# Altium project EVB-A32S1-M.PrjPcb (part 1 of 2)
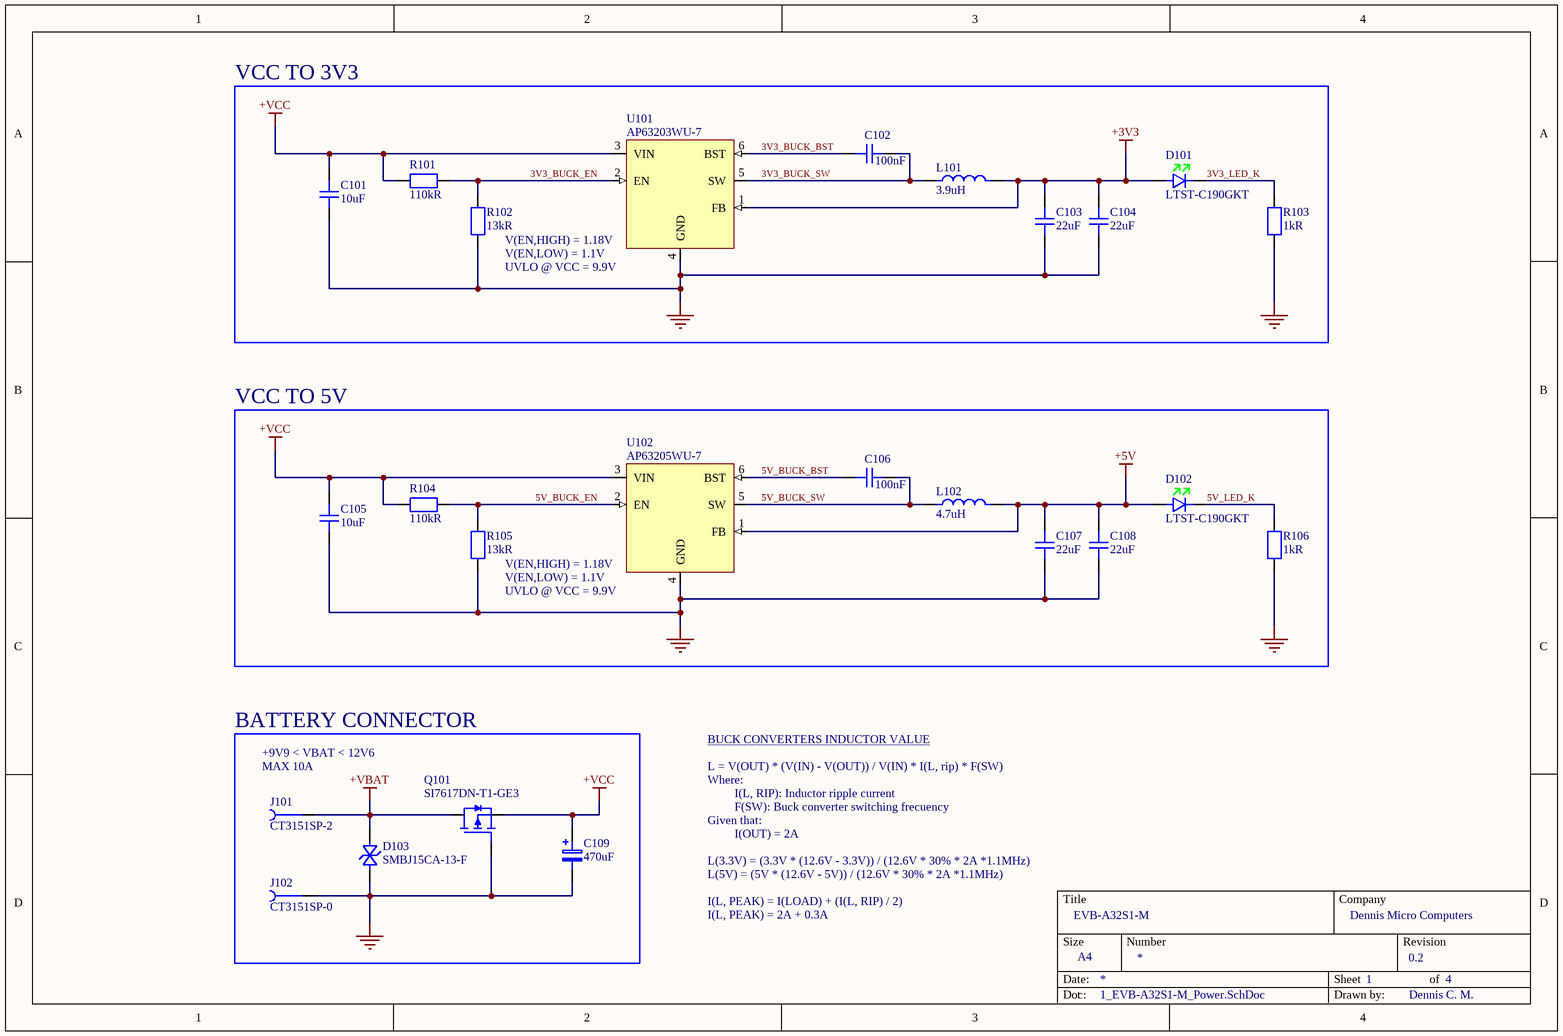
[diagram p0: 1_EVB-A32S1-M_Power.SchDoc]
CompanyName: Dennis Micro Computers; DrawnBy: Dennis C. M.; Revision: 0.2; Title: EVB-A32S1-M
4 sheets, 111 parts. Net scope: flat (ports and power ports of the same name join across sheets).
Board file: EVB-A32S1-M_PCB.PcbDoc
Sheets:
  1_EVB-A32S1-M_Power.SchDoc
  2_EVB-A32S1-M_MCU.SchDoc
  3_EVB-A32S1-M_Motor.SchDoc
  4_EVB-A32S1-M_Sensing.SchDoc

## Sheet 1_EVB-A32S1-M_Power.SchDoc: EVB-A32S1-M
size A4; SheetNumber: 1; SheetTotal: 4

### Parts
C101  value 10uF  [C_Samsung_CL_0805_A]  (hidden comment: CL21A106KOQNNNE)
C102  value 100nF  [C_Samsung_CL_0402_A]  (hidden comment: CL05B104KP5NNNC)
C103  value 22uF  [C_Yageo_CC_0805_A]  (hidden comment: CC0805MKX5R6BB226)
C104  value 22uF  [C_Yageo_CC_0805_A]  (hidden comment: CC0805MKX5R6BB226)
C105  value 10uF  [C_Samsung_CL_0805_A]  (hidden comment: CL21A106KOQNNNE)
C106  value 100nF  [C_Samsung_CL_0402_A]  (hidden comment: CL05B104KP5NNNC)
C107  value 22uF  [C_Yageo_CC_0805_A]  (hidden comment: CC0805MKX5R6BB226)
C108  value 22uF  [C_Yageo_CC_0805_A]  (hidden comment: CC0805MKX5R6BB226)
C109  value 470uF  [C_Rubycon_10x16mm_TH]  (hidden comment: 35ZLH470MEFC10X16)
D101  LTST-C190GKT  [D_LED_Lite-On_Green_0603_A]
D102  LTST-C190GKT  [D_LED_Lite-On_Green_0603_A]
D103  SMBJ15CA-13-F  [D_TVS_BI_Diodes_SMBJ15CA-13-F_A]
J101  CT3151SP-2  [J_CalTest_CT3151SP-2]
J102  CT3151SP-0  [J_CalTest_CT3151SP-0]
L101  value 3.9uH  [L_Murata_1255AY-XXXX=P3]  (hidden comment: 1255AY-3R9N=P3)
L102  value 4.7uH  [L_Murata_1255AY-XXXX=P3]  (hidden comment: 1255AY-4R7M=P3)
Q101  SI7617DN-T1-GE3  [Q_Vishay_PowerPACK-1212-8]
R101  value 110kR  [R_Yageo_RCL_0402_A]  (hidden comment: RC0402FR-07110KL)
R102  value 13kR  [R_Yageo_RCL_0402_A]  (hidden comment: RC0402FR-0713KL)
R103  value 1kR  [R_Yageo_RCL_0402_A]  (hidden comment: RC0402FR-071KL)
R104  value 110kR  [R_Yageo_RCL_0402_A]  (hidden comment: RC0402FR-07110KL)
R105  value 13kR  [R_Yageo_RCL_0402_A]  (hidden comment: RC0402FR-0713KL)
R106  value 1kR  [R_Yageo_RCL_0402_A]  (hidden comment: RC0402FR-071KL)
U101  AP63203WU-7  [U_Diodes_AP623xx]
U102  AP63205WU-7  [U_Diodes_AP623xx]

### Blocks framed on the sheet
VCC TO 3V3: C101-C104 D101 L101 R101-R103 U101
VCC TO 5V: C105-C108 D102 L102 R104-R106 U102
BATTERY CONNECTOR: C109 D103 J101 J102 Q101

### Nets
+3V3: C103.2 C104.2 D101.2 L101.2 U101.1(FB)
+5V: C107.2 C108.2 D102.2 L102.2 U102.1(FB)
+VBAT: D103.1 J101.1 Q101.1(D)
+VCC: C101.2 C105.2 C109.1 Q101.3(S) R101.2 R104.2 U101.3(VIN) U102.3(VIN)
GND: C101.1 C103.1 C104.1 C105.1 C107.1 C108.1 C109.2 D103.2 J102.1 Q101.2(G) R102.1 R103.1 R105.1 R106.1 U101.4(GND) U102.4(GND)
3V3_BUCK_BST: C102.2 U101.6(BST)
3V3_BUCK_EN: R101.1 R102.2 U101.2(EN)
3V3_BUCK_SW: C102.1 L101.1 U101.5(SW)
3V3_LED_K: D101.1 R103.2
5V_BUCK_BST: C106.2 U102.6(BST)
5V_BUCK_EN: R104.1 R105.2 U102.2(EN)
5V_BUCK_SW: C106.1 L102.1 U102.5(SW)
5V_LED_K: D102.1 R106.2

### Notes on the sheet
- (near U101) V(EN,HIGH) = 1.18V
- V(EN,LOW) = 1.1V
- (near U101) UVLO @ VCC = 9.9V
- (near U102) V(EN,HIGH) = 1.18V
- (near U102) UVLO @ VCC = 9.9V
- +9V9 < VBAT < 12V6
- (near J101) MAX 10A
- L = V(OUT) * (V(IN) - V(OUT)) / V(IN) * I(L, rip) * F(SW)
- BUCK CONVERTERS INDUCTOR VALUE
- Where:
- Given that:
- I(L, RIP): Inductor ripple current
- F(SW): Buck converter switching frecuency
- I(OUT) = 2A
- L(3.3V) = (3.3V * (12.6V - 3.3V)) / (12.6V * 30% * 2A *1.1MHz)
- L(5V) = (5V * (12.6V - 5V)) / (12.6V * 30% * 2A *1.1MHz)
- I(L, PEAK) = I(LOAD) + (I(L, RIP) / 2)
- I(L, PEAK) = 2A + 0.3A
- Title
- Company
- Size
- Date:
- A4
- Number
- Sheet
- Revision
- of
- Doc:
- Drawn by:

### Library data of the parts
C101 C105 = CMP-001-00022-4: Multilayer Ceramic Capacitor, 10 uF, 16 V, ± 10%, X5R, 0805 [2012 Metric]; Voltage Rating (DC): 16V; Dielectric: X7R; Radiation Hardening: No; Width: 0.049inch; Series: CL; Lead Free: Lead Free; Case/Package: 0805; Case Code (Metric): 2012; Construction: Flat; Height: 1.25mm; Voltage: 16V; Packaging: Tape and Reel; Voltage Rating: 16V; RoHS Compliant: Yes; Mounting Technology: Surface Mount; Case Code (Imperial): 0805; Length: 2mm; Min Operating Temperature: -55°C; Max Operating Temperature: 85°C; Depth: 1.25mm; Tolerance: 10%; Thickness: 0.055inch; ComponentLink1URL: https://mm.digikey.com/Volume0/opasdata/d220001/medias/docus/609/CL21A106KOQNNNE_Spec.pdf; Material: Ceramic; Package Quantity: 1; ComponentLink1Description: Datasheet
C102 C106 = CMP-001-00023-3: Multilayer Ceramic Capacitor, 0.1 uF, 10 V, ± 10%, X7R, 0402 [1005 Metric]; Voltage Rating: 10V; Dielectric: X7R; Height: 0.5mm; Tolerance: 10%; Voltage Rating (DC): 10V; Case/Package: 0402; RoHS Compliant: Yes; Packaging: Tape and Reel; Case Code (Imperial): 0402; Material: Ceramic; Case Code (Metric): 1005; Max Operating Temperature: 125°C; Mounting Technology: Surface Mount; Min Operating Temperature: -55°C; Series: CL; Construction: Flat; Depth: 0.5mm; Length: 1mm; Package Quantity: 1; Radiation Hardening: No; Thickness: 0.022inch; Width: 0.02inch
C103 C104 C107 C108 = CMP-001-00014-9: Multilayer Ceramic Capacitor, 22 uF, 10 V, ± 20%, X5R, 0805 [2012 Metric]; Voltage Rating (DC): 10V; Tolerance: 20%; ComponentLink1URL: https://www.yageo.com/upload/media/product/app/datasheet/mlcc/upy-gphc_x5r_4v-to-50v.pdf; Depth: 1.25mm; Width: 0.049inch; Termination: SMD/SMT; Packaging: Tape and Reel; Radiation Hardening: No; Min Operating Temperature: -55°C; RoHS Compliant: Yes; ComponentLink1Description: Datasheet; Length: 2mm; Dielectric: X5R; Case/Package: 0805; Case Code (Metric): 2012; Max Operating Temperature: 85°C; Weight: 0.000194oz; Case Code (Imperial): 0805; Lead Free: Lead Free; Mounting Technology: Surface Mount; Thickness: 0.057inch; Series: CC; Voltage Rating: 10V; Halogen Free: Halogen Free
C109 = CMP-001-00025-7: Cap Aluminum 470uF 35V 20% (10 X 16mm) Radial 5mm 1760mA 10000h 105 C Bulk; Life (Hours): 10000Hour; Lead Diameter: 0.6mm; Leakage Current: 3uA; Dielectric Material: Aluminium; Ripple Current: 1.76A; Impedance: 28mR; Tolerance: 20%; Construction: RADIAL; Voltage: 35V; Radiation Hardening: No; Lead Pitch: 5mm; Reach SVHC Compliant: No; Case/Package: Radial; Diameter: 10mm; Series: ZLH; Voltage Rating: 35V; Lead Free: Lead Free; Max Operating Temperature: 105°C; ComponentLink1URL: https://www.rubycon.co.jp/wp-content/uploads/catalog-aluminum/ZLH.pdf; Voltage Rating (AC): 35V; Min Operating Temperature: -40°C; Mounting Technology: Through Hole; Height: 16mm; RoHS Compliant: Yes; Termination: Radial; ComponentLink1Description: Datasheet; Packaging: Bulk
D101 D102 = CMP-007-00001-3: LED Uni-Color Green 565nm 2-Pin Chip LED T/R; Forward Current: 30mA; Forward Voltage: 2.1V; Luminous Intensity: 6mcd; Lens Transparency: Clear; Power Dissipation: 100mW; Lens Style: Flat,Diffused,Colorless,Rectangular,Clear; Lens Size: 0.8mm; Reverse Voltage: 5V; Viewing Angle: 130°; Test Current: 10mA; Dominant Wavelength: 569nm; Lens Color: Colorless; Number of Elements: 1; Voltage: 2V; Case Code (Imperial): 0603; Min Operating Temperature: -55°C; Case/Package: 0603; RoHS Compliant: Yes; Color: Green; Mounting Technology: Surface Mount; Case Code (Metric): 1608; Series: -; Width: 0.8mm; Packaging: Tape and Reel; Max Operating Temperature: 85°C; ComponentLink1Description: Datasheet; Length: 1.6mm; Package Quantity: 1; Height: 0.9mm; ComponentLink1URL: https://mm.digikey.com/Volume0/opasdata/d220001/medias/docus/858/LTST-C190GKT.pdf; Wavelength: 565nm; Depth: 0.8mm; Illumination Color: Green; Lead Free: Lead Free; Number of LEDs: 1; Pins: 2; Power Rating: 100mW; Radiation Hardening: No
D103 = CMP-004-00000-11: Tvs Diode, Bidir, 15V, 600W, Do-214Aa Rohs Compliant: Yes; Max Reverse Leakage Current: 5uA; Reverse Breakdown Voltage: 16.7V; Breakdown Voltage: 19.2V; Clamping Voltage: 24.4V; Power Line Protection: No; Max Surge Current: 24A; Number of Bidirectional Channels: 1; Test Current: 1mA; Value: 280pF; Polarity: Bidirectional; Diode Type: ZENER; Power Dissipation: 600W; Max Operating Temperature: 150°C; Package Quantity: 3000; Min Breakdown Voltage: 16.7V; Width: 3.9mm; Series: SMBJ; Peak Pulse Power: 600W; Mounting Technology: Surface Mount; Working Voltage: 15V; Peak Pulse Current: 24A; Min Operating Temperature: -55°C; Max Output current: 24A; Pins: 2; Termination: SMD/SMT; Leakage Current: 5uA; ComponentLink1Description: Datasheet; Max Breakdown Voltage: 19.2V; Case/Package: SMB; Number of Elements: 1; Max Power Dissipation: 600W; ComponentLink1URL: https://www.bourns.com/docs/Product-Datasheets/SMBJ.pdf; Lead Free: Lead Free; Packaging: Tape and Reel; Clamping Voltage-Max: 24.4V; RoHS Compliant: Yes; Length: 4.57mm; Voltage Rating (DC): 15V; Direction: Bidirectional; Radiation Hardening: No; Height: 2.62mm; Reverse Standoff Voltage: 15V
J101 = CMP-002-00001-14: Conn 4mm Safety Banana Jack F 1 POS Solder RA Thru-Hole 1 Port Bag; pin to pad: 1>1+2+3+4; Body Material: Nylon,Polyamide,PA66; Insulation: Mating End Insulated; Gender: Female; Min Operating Temperature: -20°C; Termination: Solder; ComponentLink1Description: Datasheet; Mounting Technology: Through Hole,Panel; Max Operating Temperature: 80°C; Color: Red; ComponentLink1URL: https://mm.digikey.com/Volume0/opasdata/d220001/medias/docus/4846/DS_1768_Catalog.pdf; Contact Material: Brass; Contact Plating: Nickel; Series: Cal Test; Packaging: Bulk
J102 = CMP-002-00000-17: Conn 4mm Safety Banana Jack F 1 POS Solder RA Thru-Hole 1 Port Bag; pin to pad: 1>1+2+3+4; Body Material: Nylon,Polyamide,PA66; Insulation: Mating End Insulated; Gender: Female; Packaging: Bulk; Series: Cal Test; Color: Black; Min Operating Temperature: -20°C; Contact Material: Brass; ComponentLink1URL: https://mm.digikey.com/Volume0/opasdata/d220001/medias/docus/4846/DS_1768_Catalog.pdf; Mounting Technology: Through Hole,Panel; Contact Plating: Nickel; ComponentLink1Description: Datasheet; Max Operating Temperature: 80°C; Termination: Solder
L101 = CMP-006-00002-7: Inductor Power Shielded Wirewound 3.9uH 30% 100KHz Ferrite 4.2A 0.0264Ohm DCR 2424 T/R; DC Resistance (DCR): 26.4mR; Saturation Current: 4.7A; Core Material: Ferrite; Tolerance: 30%; Shielding: Shielded; Length: 0.248inch; Packaging: Cut Tape; Min Operating Temperature: -40°C; ComponentLink1URL: https://search.murata.co.jp/Ceramy/image/img/P02/J(E)TE243B-0037_DG6045C_reference.pdf; RoHS Compliant: Yes; ComponentLink1Description: Datasheet; Height - Seated (Max): 0.177inch; Max Operating Temperature: 85°C; Mounting Technology: Surface Mount; Series: -; Case/Package: Nonstandard; Width: 0.248inch; Current Rating: 4.2A; Test Frequency: 100kHz
L102 = CMP-006-00001-10: Inductor Power Shielded Wirewound 4.7uH 20% 100KHz Ferrite 4A 0.0276Ohm DCR 2424 T/R; DC Resistance (DCR): 27.6mR; Current Rating: 4.5A; ComponentLink1Description: Datasheet; Packaging: Cut Tape; Height - Seated (Max): 0.177inch; ESR: 27.6mR; Core Material: Ferrite; Inductance Tolerance: 20%; ComponentLink1URL: https://search.murata.co.jp/Ceramy/image/img/P02/J(E)TE243B-0037_DG6045C_reference.pdf; Width: 0.248inch; Saturation Current: 4.5A; Min Operating Temperature: -40°C; Case/Package: Nonstandard; Series: DG6045C; RoHS Compliant: Yes; Tolerance: 20%; Length: 0.248inch; Test Frequency: 100kHz; Shielding: Shielded; Max Operating Temperature: 85°C; Height: 4.5mm; Max DC Current: 4A; RMS Current (Irms): 4A; Mounting Technology: Surface Mount
Q101 = CMP-00000-19: P CHANNEL MOSFET, -30V, 35A; Transistor; Transistor Polarity: P Channel; Continuous Drain Current Id: -35A; Source; pin to pad: 1>5+6+7+8 2>4 3>1+2+3; Rise Time: 43ns; Drain to Source Resistance: 12.3mR; Turn-Off Delay Time: 30ns; Turn-On Delay Time: 40ns; Threshold Voltage: -2.5V; Max Power Dissipation: 52W; Fall Time: 11ns; Power Dissipation: 3.7W; Polarity: P-CHANNEL; Number of Elements: 1; Input Capacitance: 1.8nF; Gate to Source Voltage (Vgs): 25V; Drain to Source Breakdown Voltage: -30V; Pins: 8; Max Operating Temperature: 150°C; ComponentLink1Description: Datasheet; Continuous Drain Current (ID): -35A; Mounting Technology: Surface Mount; Rds On Max: 12.3mR; Packaging: Tape and Reel; ComponentLink1URL: https://www.vishay.com/docs/65164/si7617dn.pdf; Min Operating Temperature: -55°C; Reach SVHC Compliant: No; Drain to Source Voltage (Vdss): -30V; RoHS Compliant: Yes; Package Quantity: 3000; Number of Channels: 1; Lead Free: Lead Free; Series: TrenchFET®; Radiation Hardening: No; Height: 1.12mm
R101 R104 = CMP-009-00000-11: SMD Chip Resistor, 110 kOhm, ± 1%, 63 mW, 0402 [1005 Metric], Thick Film, General Purpose; Max Power Dissipation: 63mW; Voltage Rating (DC): 50V; Temperature Coefficient: 100ppm/°C; Tolerance: 1%; Case Code (Metric): 1005; Case/Package: 0402; ComponentLink1Description: Datasheet; Depth: 0.5mm; Length: 1mm; Packaging: Tape and Reel; Max Operating Temperature: 155°C; Reach SVHC Compliant: Unknown; Case Code (Imperial): 0402; ComponentLink1URL: https://www.yageo.com/upload/media/product/products/datasheet/rchip/PYu-RC_Group_51_RoHS_L_12.pdf; Termination: SMD/SMT; Construction: Rectangular; RoHS Compliant: Yes; Min Operating Temperature: -55°C; Working Voltage: 50V; Technology: THICK FILM; Resistor Type: Thick Film; Military Standard: Not; Number of Terminations: 2; Voltage Rating: 50V; Series: RC; Power Rating: 63mW; Features: Moisture Resistant; Resistance Tolerance: 1%
R102 R105 = CMP-009-00001-11: SMD Chip Resistor, 13 kOhm, ± 1%, 63 mW, 0402 [1005 Metric], Thick Film, General Purpose; Temperature Coefficient: 100ppm/°C; Voltage Rating: 50V; Max Power Dissipation: 63mW; Power Rating: 62.5mW; ComponentLink1Description: Datasheet; Mounting Technology: Surface Mount; Max Operating Temperature: 155°C; Technology: THICK FILM; Package Quantity: 10000; Case Code (Imperial): 0402; Number of Terminations: 2; Lead Free: Lead Free; Working Voltage: 50V; Min Operating Temperature: -55°C; Width: 0.02inch; Height: 0.016inch; Tolerance: 1%; Packaging: Tape and Reel; Length: 0.039inch; Features: Moisture Resistant; Case Code (Metric): 1005; Case/Package: 0402; Depth: 0.5mm; Termination: SMD/SMT; ComponentLink1URL: https://www.yageo.com/upload/media/product/products/datasheet/rchip/PYu-RC_Group_51_RoHS_L_12.pdf; Voltage Rating (DC): 50V; Series: RC; RoHS Compliant: Yes
R103 R106 = CMP-009-00002-11: SMD Chip Resistor, 1 kOhm, ± 1%, 62.5 mW, 0402 [1005 Metric], Thick Film, General Purpose; Temperature Coefficient: 100ppm/°C; Voltage Rating (AC): 50V; Power Rating: 62.5mW; Max Power Dissipation: 63mW; Features: Moisture Resistant; Width: 0.5mm; Resistor Type: Thick Film; Packaging: Tape and Reel; Max Operating Temperature: 155°C; Construction: Rectangular; Reach SVHC Compliant: No; Termination: SMD/SMT; Voltage Rating (DC): 50V; Tolerance: 1%; ComponentLink1Description: Datasheet; Number of Terminations: 2; Depth: 0.5mm; Resistance Tolerance: 1%; ComponentLink1URL: https://www.yageo.com/upload/media/product/products/datasheet/rchip/PYu-RC_Group_51_RoHS_L_12.pdf; Height: 0.32mm; Technology: THICK FILM; RoHS Compliant: Yes; Min Operating Temperature: -55°C; Lead Free: Lead Free; Military Standard: Not; Series: RC; Case/Package: 0402; Case Code (Imperial): 0402; Pins: 2; Case Code (Metric): 1005; Voltage Rating: 50V; Length: 1mm
U101 = CMP-019-00004-17: AP63203 Series 3.3 V 2 A SMT Fixed Low IQ Synchronous Buck - TSOT-26; Max Duty Cycle: 100%; Output Voltage: 3.3V; Number of Outputs: 1; Max Supply Voltage: 32V; Switching Frequency: 1.1MHz; Min Supply Voltage: 3.8V; Nominal Supply Current: 22uA; Output Current: 2A; Min Operating Temperature: -40°C; ComponentLink1URL: https://www.diodes.com/assets/Datasheets/AP63200-AP63201-AP63203-AP63205.pdf; ComponentLink1Description: Datasheet; Max Operating Temperature: 85°C; Height: 1mm
U102 = CMP-019-00003-17: AP63205 Series 32 V 2 A 1.1 MHz Synchronous Buck Converter -TSOT-26; Number of Outputs: 1; Max Duty Cycle: 100%; Output Current: 2A; Switching Frequency: 1.1MHz; Max Supply Voltage: 32V; Output Voltage: 5V; Nominal Supply Current: 22uA; Min Supply Voltage: 3.8V; ComponentLink1URL: https://www.diodes.com/assets/Datasheets/AP63200-AP63201-AP63203-AP63205.pdf; Min Operating Temperature: -40°C; Height: 1mm; Max Operating Temperature: 85°C; ComponentLink1Description: Datasheet

## Sheet 2_EVB-A32S1-M_MCU.SchDoc: EVB-A32S1-M
size A4; SheetNumber: 2; SheetTotal: 4
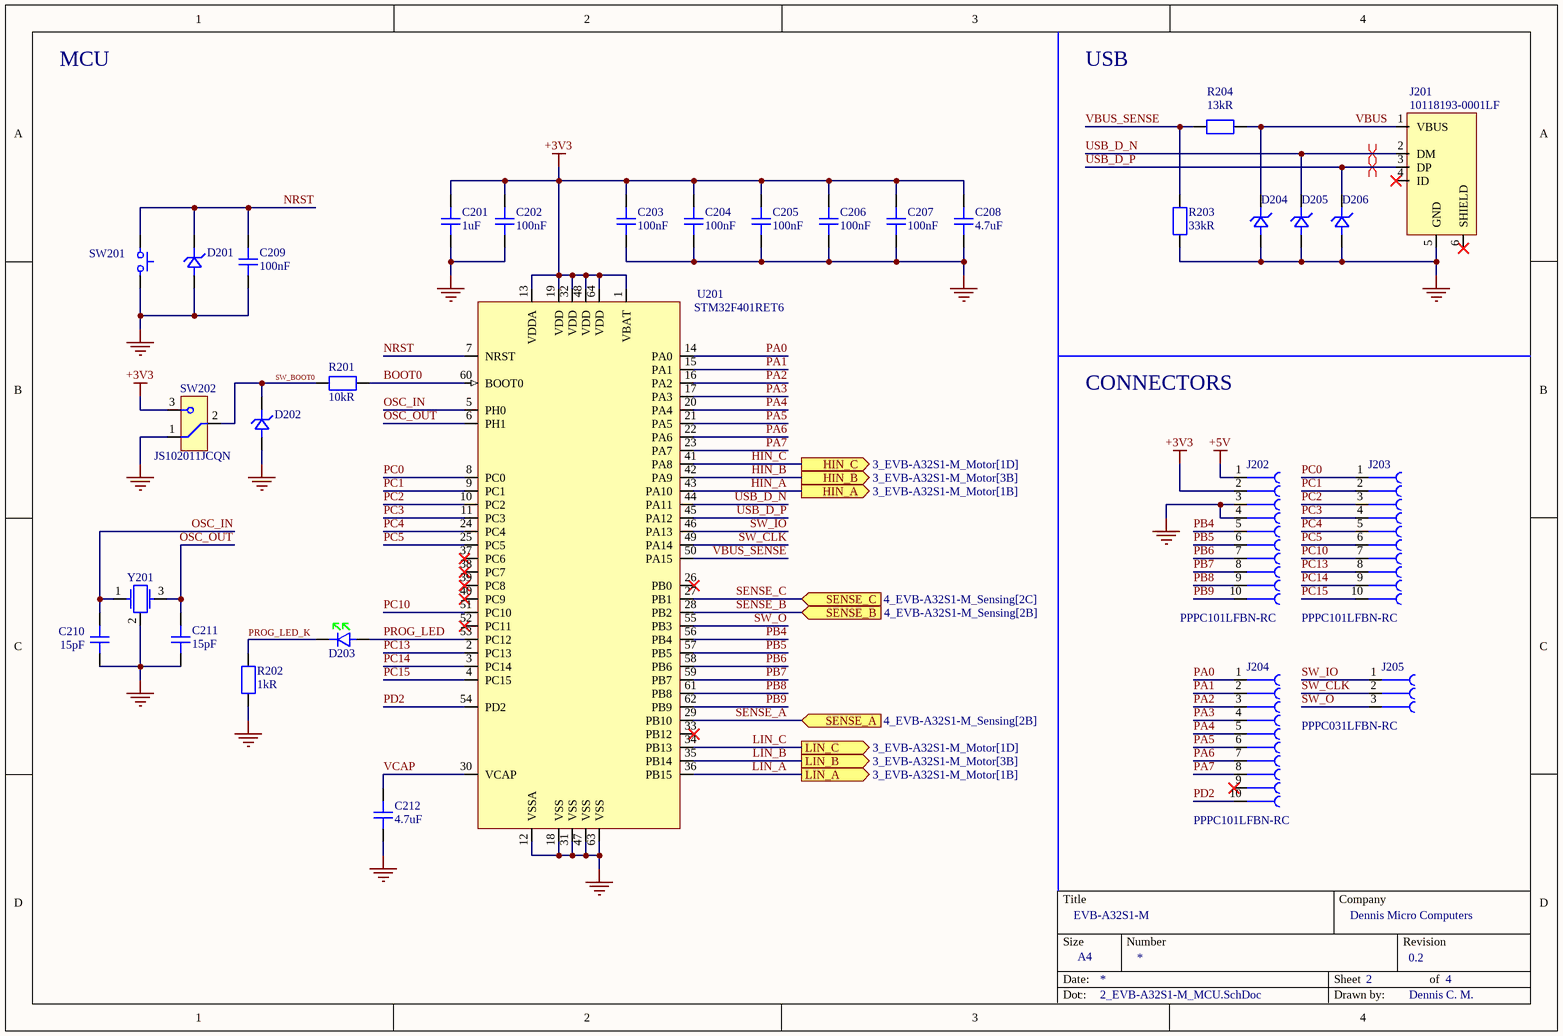
[diagram p1: 2_EVB-A32S1-M_MCU.SchDoc]

### Parts
C201  value 1uF  [C_Yageo_CC_0603_A]  (hidden comment: CC0603KRX7R7BB105)
C202  value 100nF  [C_Samsung_CL_0402_A]  (hidden comment: CL05B104KP5NNNC)
C203  value 100nF  [C_Samsung_CL_0402_A]  (hidden comment: CL05B104KP5NNNC)
C204  value 100nF  [C_Samsung_CL_0402_A]  (hidden comment: CL05B104KP5NNNC)
C205  value 100nF  [C_Samsung_CL_0402_A]  (hidden comment: CL05B104KP5NNNC)
C206  value 100nF  [C_Samsung_CL_0402_A]  (hidden comment: CL05B104KP5NNNC)
C207  value 100nF  [C_Samsung_CL_0402_A]  (hidden comment: CL05B104KP5NNNC)
C208  value 4.7uF  [C_Samsung_CL_0402_A]  (hidden comment: CL05A475MP5NRNC)
C209  value 100nF  [C_Samsung_CL_0402_A]  (hidden comment: CL05B104KP5NNNC)
C210  value 15pF  [C_Yageo_CC_0402_A]  (hidden comment: CC0402JRNPO9BN150)
C211  value 15pF  [C_Yageo_CC_0402_A]  (hidden comment: CC0402JRNPO9BN150)
C212  value 4.7uF  [C_Samsung_CL_0402_A]  (hidden comment: CL05A475MP5NRNC)
D201  D5V0F1U2S9-7  [D_TVS_Uni_Diodes_SOD-923_B]  (value not drawn)
D202  D5V0F1U2S9-7  [D_TVS_Uni_Diodes_SOD-923_B]  (value not drawn)
D203  LTST-C190GKT  [D_LED_Lite-On_Green_0603_A]  (value not drawn)
D204  D5V0F1U2S9-7  [D_TVS_Uni_Diodes_SOD-923_B]  (value not drawn)
D205  D5V0F1U2S9-7  [D_TVS_Uni_Diodes_SOD-923_B]  (value not drawn)
D206  D5V0F1U2S9-7  [D_TVS_Uni_Diodes_SOD-923_B]  (value not drawn)
J201  10118193-0001LF  [J_USB_Micro-B_Amphenol_10118193-0001LF]
J202  PPPC101LFBN-RC  [J_Sullins_01x10_Socket_2.54mm]
J203  PPPC101LFBN-RC  [J_Sullins_01x10_Socket_2.54mm]
J204  PPPC101LFBN-RC  [J_Sullins_01x10_Socket_2.54mm]
J205  PPPC031LFBN-RC  [J_Sullins_01x03_Socket_2.54mm]
R201  value 10kR  [R_Yageo_RCL_0402_A]  (hidden comment: RC0402FR-0710KL)
R202  value 1kR  [R_Yageo_RCL_0402_A]  (hidden comment: RC0402FR-071KL)
R203  value 33kR  [R_Yageo_RCL_0402_A]  (hidden comment: RC0402FR-0733KL)
R204  value 13kR  [R_Yageo_RCL_0402_A]  (hidden comment: RC0402FR-0713KL)
SW201  PTS647SN50SMTR2LFS  [SW_Tactitle_SPST_C&K_PTS647SN50SMTR2LFS]  (value not drawn)
SW202  JS102011JCQN  [SW_Slide_C&K_JS102011JCQN]
U201  STM32F401RET6  [U_ST_LQFP64_B]
Y201  ECS-240-12-37B-CKY-TR  [Y_Crystal_GND24_ECS_240-12-37B-CKY-TR]  (value not drawn)

### Ports
HIN_A (out, see 3_EVB-A32S1-M_Motor[1B]), HIN_B (out, see 3_EVB-A32S1-M_Motor[3B]), HIN_C (out, see 3_EVB-A32S1-M_Motor[1D]), LIN_A (out, see 3_EVB-A32S1-M_Motor[1B]), LIN_B (out, see 3_EVB-A32S1-M_Motor[3B]), LIN_C (out, see 3_EVB-A32S1-M_Motor[1D]), SENSE_A (in, see 4_EVB-A32S1-M_Sensing[2B]), SENSE_B (in, see 4_EVB-A32S1-M_Sensing[2B]), SENSE_C (in, see 4_EVB-A32S1-M_Sensing[2C])

### Nets
+3V3: C201.2 C202.2 C203.2 C204.2 C205.2 C206.2 C207.2 C208.2 J202.2 SW202.3 U201.1(VBAT) U201.13(VDDA) U201.19(VDD) U201.32(VDD) U201.48(VDD) U201.64(VDD)
+5V: J202.1
GND: C201.1 C202.1 C203.1 C204.1 C205.1 C206.1 C207.1 C208.1 C209.1 C210.1 C211.1 C212.1 D201.2 D202.2 D204.2 D205.2 D206.2 J201.5(GND) J202.3 J202.4 R202.1 R203.1 SW201.2 SW202.1 U201.12(VSSA) U201.18(VSS) U201.31(VSS) U201.47(VSS) U201.63(VSS) Y201.2
BOOT0: R201.2 U201.60(BOOT0)
HIN_A: U201.43(PA10) ; port HIN_A
HIN_B: U201.42(PA9) ; port HIN_B
HIN_C: U201.41(PA8) ; port HIN_C
LIN_A: U201.36(PB15) ; port LIN_A
LIN_B: U201.35(PB14) ; port LIN_B
LIN_C: U201.34(PB13) ; port LIN_C
NRST: C209.2 D201.1 SW201.1 U201.7(NRST)
OSC_IN: C210.2 U201.5(PH0) Y201.1
OSC_OUT: C211.2 U201.6(PH1) Y201.3
PA0: J204.1 U201.14(PA0)
PA1: J204.2 U201.15(PA1)
PA2: J204.3 U201.16(PA2)
PA3: J204.4 U201.17(PA3)
PA4: J204.5 U201.20(PA4)
PA5: J204.6 U201.21(PA5)
PA6: J204.7 U201.22(PA6)
PA7: J204.8 U201.23(PA7)
PB4: J202.5 U201.56(PB4)
PB5: J202.6 U201.57(PB5)
PB6: J202.7 U201.58(PB6)
PB7: J202.8 U201.59(PB7)
PB8: J202.9 U201.61(PB8)
PB9: J202.10 U201.62(PB9)
PC0: J203.1 U201.8(PC0)
PC1: J203.2 U201.9(PC1)
PC2: J203.3 U201.10(PC2)
PC3: J203.4 U201.11(PC3)
PC4: J203.5 U201.24(PC4)
PC5: J203.6 U201.25(PC5)
PC10: J203.7 U201.51(PC10)
PC13: J203.8 U201.2(PC13)
PC14: J203.9 U201.3(PC14)
PC15: J203.10 U201.4(PC15)
PD2: J204.10 U201.54(PD2)
PROG_LED: D203.2 U201.53(PC12)
PROG_LED_K: D203.1 R202.2
SENSE_A: U201.29(PB10) ; port SENSE_A
SENSE_B: U201.28(PB2) ; port SENSE_B
SENSE_C: U201.27(PB1) ; port SENSE_C
SW_BOOT0: D202.1 R201.1 SW202.2
SW_CLK: J205.2 U201.49(PA14)
SW_IO: J205.1 U201.46(PA13)
SW_O: J205.3 U201.55(PB3)
USB_D_N: D205.1 J201.2(DM) U201.44(PA11)
USB_D_P: D206.1 J201.3(DP) U201.45(PA12)
VBUS: D204.1 J201.1(VBUS) R204.2
VBUS_SENSE: R203.2 R204.1 U201.50(PA15)
VCAP: C212.2 U201.30(VCAP)

Not connected (* = marked no-connect by the designer): J201 4(ID)* 6(SHIELD)*; J204 9*; U201 26(PB0)* 33(PB12)* 37(PC6)* 38(PC7)* 39(PC8)* 40(PC9)* 52(PC11)*

### Layout directives
differential pair; differential pair class DIFF_USB: USB_D_N, USB_D_P

### Notes on the sheet
- MCU
- USB
- CONNECTORS
- Title
- Company
- Size
- Date:
- A4
- Number
- Sheet
- Revision
- of
- Doc:
- Drawn by:

### Library data of the parts
C201 = CMP-001-00019-5: Multilayer Ceramic Capacitor, 1 uF, 16 V, ± 10%, X7R, 0603 [1608 Metric]; Voltage: 16V; Dissipation Factor: 5%; Case Code (Imperial): 0603; ComponentLink1URL: https://www.yageo.com/upload/media/product/productsearch/datasheet/mlcc/UPY-GPHC_X7R_6.3V-to-250V_24.pdf; Pins: 2; Width: 0.031inch; Tolerance: 10%; Height: 0.8mm; Radiation Hardening: No; Lead Free: Lead Free; Material: Ceramic; Reach SVHC Compliant: Unknown; Case Code (Metric): 1608; Min Operating Temperature: -55°C; Case/Package: 0603; Package Quantity: 1; Thickness: 0.035inch; Packaging: Tape and Reel; Series: CC; Termination: SMD/SMT; Max Operating Temperature: 125°C; Construction: Flat; Depth: 0.8mm; Halogen Free: Halogen Free; RoHS Compliant: Yes; Voltage Rating (DC): 16V; Dielectric: X7R; Length: 1.6mm; Voltage Rating: 16V; Mounting Technology: Surface Mount; ComponentLink1Description: Datasheet
C202-C207 C209 = CMP-001-00023-3: as C102 on sheet 1_EVB-A32S1-M_Power; Dielectric: X7R; Height: 0.5mm; Tolerance: 10%; Voltage Rating (DC): 10V; Case/Package: 0402; RoHS Compliant: Yes; Packaging: Tape and Reel; Case Code (Imperial): 0402; Material: Ceramic; Case Code (Metric): 1005; Max Operating Temperature: 125°C; Mounting Technology: Surface Mount; Min Operating Temperature: -55°C; Series: CL; Construction: Flat; Depth: 0.5mm; Length: 1mm; Package Quantity: 1; Radiation Hardening: No; Thickness: 0.022inch; Width: 0.02inch
C208 C212 = CMP-001-00024-3: Multilayer Ceramic Capacitor, 4.7 uF, 10 V, ± 20%, X5R, 0402 [1005 Metric]; Voltage Rating: 10V; Packaging: Cut Tape; Tolerance: 20%; Case Code (Metric): 1005; ComponentLink1Description: Datasheet; Mounting Technology: Surface Mount; ComponentLink1URL: https://mm.digikey.com/Volume0/opasdata/d220001/medias/docus/863/CL05A475MP5NRNC_Spec.pdf; Lead Free: Lead Free; Series: CL; Min Operating Temperature: -55°C; Material: Ceramic; Case Code (Imperial): 0402; Max Operating Temperature: 85°C; Dielectric: X5R; RoHS Compliant: Yes; Case/Package: 0402; Height: 550um
C210 C211 = CMP-001-00017-14: Multilayer Ceramic Capacitor, 15 pF, 10 V, ± 5%, X7R, 0402 [1005 Metric]; Insulation Resistance: 100GR; Dielectric: C0G; Voltage Rating (DC): 50V; Temperature Coefficient: 30ppm/°C; ComponentLink1URL: https://www.yageo.com/upload/media/product/productsearch/datasheet/mlcc/UPY-GP_NP0_16V-to-50V_18.pdf; Length: 1mm; Thickness: 0.022inch; Packaging: Tape and Reel; RoHS Compliant: Yes; Height: 0.5mm; Max Operating Temperature: 125°C; Depth: 0.5mm; Radiation Hardening: No; Termination: SMD/SMT; Width: 0.02inch; Series: CC; Tolerance: 5%; Lead Free: Lead Free; ComponentLink1Description: Datasheet; Package Quantity: 1; Min Operating Temperature: -55°C; Voltage: 50V; Case/Package: 0402; Reach SVHC Compliant: No; Case Code (Metric): 1005; Case Code (Imperial): 0402; Voltage Rating (AC): 50V; Mounting Technology: Surface Mount; Halogen Free: Halogen Free; Dielectric Material: Ceramic; Pins: 2; Voltage Rating: 50V; Material: Ceramic
D201 D202 D204-D206 = CMP-004-00007-2: Diode TVS Dual Uni-Dir 5.5V 250000W 2-Pin SOD-923 T/R; Max Power Dissipation: 250mW; ESD Protection: Yes; Max Reverse Leakage Current: 100nA; Max Surge Current: 1.5A; Diode Type: ZENER; Direction: Unidirectional; Breakdown Voltage: 6V; Clamping Voltage: 10V; Value: 5E-13F; Peak Pulse Power: 250kW; Number of Unidirectional Channels: 1; ComponentLink1Description: Datasheet; Working Voltage: 5.5V; Reverse Standoff Voltage: 5.5V; Case/Package: SOD-923-2; Max Operating Temperature: 150°C; Power Line Protection: Yes; Mounting Technology: Surface Mount; Peak Pulse Current: 1.5A; Packaging: Tape and Reel; RoHS Compliant: Yes; Package Quantity: 10000; Contact Plating: Tin,Matte; Series: -; Termination: SMD/SMT; Polarity: Unidirectional; Min Breakdown Voltage: 6V; Min Operating Temperature: -65°C; ComponentLink1URL: https://www.diodes.com/assets/Datasheets/D5V0F1U2S9.pdf
D203 = CMP-007-00001-3: LED Uni-Color Green 565nm 2-Pin Chip LED T/R; Viewing Angle: 130°; Lens Transparency: Clear; Reverse Voltage: 5V; Lens Size: 0.8mm; Lens Color: Colorless; Lens Style: Flat,Diffused,Colorless,Rectangular,Clear; Power Dissipation: 100mW; Forward Voltage: 2.1V; Dominant Wavelength: 569nm; Test Current: 10mA; Forward Current: 30mA; Luminous Intensity: 6mcd; Number of Elements: 1; Voltage: 2V; Series: -; ComponentLink1URL: https://mm.digikey.com/Volume0/opasdata/d220001/medias/docus/858/LTST-C190GKT.pdf; Packaging: Tape and Reel; Package Quantity: 1; Case Code (Imperial): 0603; Height: 0.9mm; ComponentLink1Description: Datasheet; Color: Green; Case Code (Metric): 1608; Min Operating Temperature: -55°C; Wavelength: 565nm; Length: 1.6mm; Max Operating Temperature: 85°C; Case/Package: 0603; RoHS Compliant: Yes; Mounting Technology: Surface Mount; Width: 0.8mm; Depth: 0.8mm; Illumination Color: Green; Lead Free: Lead Free; Number of LEDs: 1; Pins: 2; Power Rating: 100mW; Radiation Hardening: No
J201 = CMP-002-00002-12: Usb Connector, 5 Contact(S), Female, Right Angle, Surface Mount Terminal, Locking, Receptacle; Number of Contacts: 5; Current Rating: 1.8A; Connector Type: USB,Receptacle; Pitch: 650um; Number of Ports: 1; Voltage Rating: 100V; USB Standard: USB 2.0; Insulation Resistance: 1GR; Pins: 11; Termination: Solder; Height: 3mm; Packaging: Tape and Reel; Max Operating Temperature: 85°C; Radiation Hardening: No; Features: Shielded; Contact Material: Nickel,Gold; Series: -; Orientation: Right Angle; Min Operating Temperature: -55°C; ComponentLink2URL: https://cdn.amphenol-cs.com/media/wysiwyg/files/documentation/datasheet/inputoutput/io_usb_micro.pdf; Color: Black; Housing Material: Polymer; Mounting Technology: Surface Mount,Horizontal; ComponentLink1Description: Drawing; Depth: 5.67mm; Package Quantity: 1200; ComponentLink1URL: https://cdn.amphenol-cs.com/media/wysiwyg/files/drawing/10118193.pdf; ComponentLink2Description: Datasheet; Flammability Rating: UL94 V-0; Length: 7.86mm; Gender: Female; Contact Plating: Gold; Max Voltage Rating (AC): 100V
J202-J204 = CMP-002-00003-9: 10 Position Total Single Row 2.54 mm Pitch Straight Female Header; Voltage Rating: 250V; Number of Contacts: 10; Pitch: 0.1inch; Current Rating: 3A; Connector Type: Header; Number of Rows: 1; Package Quantity: 1000; Contact Type: Female Socket; Color: Black; Min Operating Temperature: -40°C; RoHS Compliant: Yes; Length: 25.9mm; ComponentLink1URL: https://mm.digikey.com/Volume0/opasdata/d220001/medias/docus/937/Female_Headers.100_DS.pdf; ComponentLink1Description: Datasheet; Height: 8.5mm; Contact Plating: Gold; Width: 2.5mm; Packaging: Bulk; Mounting Technology: Through Hole; Contact Material: Bronze,Nickel,Gold; Lead Free: Lead Free; Termination: Solder; Housing Material: Plastic; Number of Positions: 10; Max Operating Temperature: 105°C
J205 = CMP-002-00004-17: 3 Position Total Single Row 2.54 mm Pitch Straight Female Header; Voltage Rating: 250V; Number of Positions: 3; Pitch: 2.54mm; Series: -; Length: 8.12mm; Connector Type: Header; Insulation Color: Black; Insulation Material: Polyester; Height: 8.5mm; ComponentLink1Description: Datasheet; Termination: Solder; Contact Shape: Square; Width: 2.5mm; Fastening Type: Pull; RoHS Compliant: Yes; Contact Finish - Mating: GOLD; Number of Rows: 1; Min Operating Temperature: -40°C; Max Operating Temperature: 105°C; Flammability Rating: UL94 V-0; Contact Material: Bronze; Packaging: Tray; Contact Type: Female Socket; Lead Free: Lead Free; Mounting Technology: Through Hole; ComponentLink1URL: https://mm.digikey.com/Volume0/opasdata/d220001/medias/docus/937/Female_Headers.100_DS.pdf; Housing Material: Plastic
R201 = CMP-009-00003-11: SMD Chip Resistor, 10 kOhm, ± 1%, 62.5 mW, 0402 [1005 Metric], Thick Film, General Purpose; Power Rating: 62.5mW; Max Power Dissipation: 63mW; Temperature Coefficient: 100ppm/°C; Voltage Rating (DC): 50V; Number of Terminations: 2; Width: 0.5mm; Resistance Tolerance: 1%; Length: 1mm; Lead Pitch: 0.2mm; Case Code (Metric): 1005; Case Code (Imperial): 0402; Construction: Rectangular; Tolerance: 1%; ComponentLink1URL: https://www.yageo.com/upload/media/product/products/datasheet/rchip/PYu-RC_Group_51_RoHS_L_12.pdf; Max Operating Temperature: 155°C; Series: RC; Military Standard: Not; Depth: 0.5mm; ComponentLink1Description: Datasheet; Features: Moisture Resistant; Termination: SMD/SMT; Pins: 2; Lead Free: Lead Free; Min Operating Temperature: -55°C; Resistor Type: Thick Film; Voltage Rating: 50V; Case/Package: 0402; Packaging: Tape and Reel; RoHS Compliant: Yes; Reach SVHC Compliant: Unknown
R202 = CMP-009-00002-11: SMD Chip Resistor, 1 kOhm, ± 1%, 62.5 mW, 0402 [1005 Metric], Thick Film, General Purpose; Temperature Coefficient: 100ppm/°C; Max Power Dissipation: 63mW; Voltage Rating (AC): 50V; Power Rating: 62.5mW; Min Operating Temperature: -55°C; Case Code (Metric): 1005; Number of Terminations: 2; Case Code (Imperial): 0402; Pins: 2; Depth: 0.5mm; Construction: Rectangular; Voltage Rating: 50V; RoHS Compliant: Yes; Series: RC; Resistor Type: Thick Film; Length: 1mm; Voltage Rating (DC): 50V; Case/Package: 0402; Features: Moisture Resistant; Reach SVHC Compliant: No; Lead Free: Lead Free; Termination: SMD/SMT; Height: 0.32mm; Tolerance: 1%; ComponentLink1Description: Datasheet; Packaging: Tape and Reel; Width: 0.5mm; Resistance Tolerance: 1%; Military Standard: Not; ComponentLink1URL: https://www.yageo.com/upload/media/product/products/datasheet/rchip/PYu-RC_Group_51_RoHS_L_12.pdf; Max Operating Temperature: 155°C; Technology: THICK FILM
R203 = CMP-009-00005-12: SMD Chip Resistor, 33 kOhm, ± 1%, 63 mW, 0402 [1005 Metric], Thick Film, General Purpose; Power Rating: 63mW; Temperature Coefficient: 100ppm/°C; Voltage Rating (AC): 50V; Tolerance: 1%; Military Standard: Not; Features: Moisture Resistant; RoHS Compliant: Yes; Construction: Rectangular; Number of Terminations: 2; Min Operating Temperature: -55°C; Case Code (Metric): 1005; Resistor Type: Thick Film; Max Power Dissipation: 63mW; Voltage Rating (DC): 50V; Pins: 2; Series: RC; Termination: SMD/SMT; ComponentLink1Description: Datasheet; Max Operating Temperature: 155°C; Case/Package: 0402; Reach SVHC Compliant: No; Case Code (Imperial): 0402; Height: 0.016inch; Depth: 0.5mm; Length: 1mm; Package Quantity: 1; Lead Free: Lead Free; Resistance Tolerance: 1%; Weight: 2.3E-05oz; Width: 0.5mm; Packaging: Tape and Reel; Voltage Rating: 50V; ComponentLink1URL: https://www.yageo.com/upload/media/product/products/datasheet/rchip/PYu-RC_Group_51_RoHS_L_12.pdf
R204 = CMP-009-00001-11: SMD Chip Resistor, 13 kOhm, ± 1%, 63 mW, 0402 [1005 Metric], Thick Film, General Purpose; Voltage Rating (DC): 50V; Temperature Coefficient: 100ppm/°C; Max Power Dissipation: 63mW; Power Rating: 62.5mW; Package Quantity: 10000; Packaging: Tape and Reel; Max Operating Temperature: 155°C; Termination: SMD/SMT; Mounting Technology: Surface Mount; Min Operating Temperature: -55°C; Series: RC; Width: 0.02inch; Lead Free: Lead Free; Case Code (Metric): 1005; Tolerance: 1%; Working Voltage: 50V; Voltage Rating: 50V; ComponentLink1URL: https://www.yageo.com/upload/media/product/products/datasheet/rchip/PYu-RC_Group_51_RoHS_L_12.pdf; Case/Package: 0402; Length: 0.039inch; Height: 0.016inch; ComponentLink1Description: Datasheet; Technology: THICK FILM; Depth: 0.5mm; RoHS Compliant: Yes; Features: Moisture Resistant; Case Code (Imperial): 0402; Number of Terminations: 2
SW201 = CMP-011-00000-13: Switch Tactile N.O. SPST Round Button Gull Wing 0.05A 12VDC 100000Cycles 0.98N SMD T/R; pin to pad: 1>1+2 2>3+4; Ratings: IP40; Switch Function: Off-Mom; Illumination Type: Non-Illuminated; Actuator Type: Standard; Number of Positions: 2; Operating Force: 100gf; Switch Travel: 0.25mm; ComponentLink1URL: https://www.ckswitches.com/media/2567/pts647.pdf; Series: PTS647; Throw Configuration: SPST; Max Operating Temperature: 70°C; Mechanical Life: 100000Cycles; Min Operating Temperature: -20°C; Packaging: Cut Tape; Mounting Technology: Surface Mount; ComponentLink1Description: Datasheet; Termination: Gull Wing
SW202 = CMP-011-00001-10: JS Series Sub-Miniature Slide Switch SPDT On-On Top Slide 0.3A 6VDC J-Lead Surface Mount T/R; Voltage Rating (DC): 6V; Switch Travel: 2mm; Actuator Material: Nylon,Polyamide,PA46; Electrical Life: 5000Cycles; Actuator Type: Standard; Max Operating Temperature: 85°C; ComponentLink1Description: Datasheet; Mounting Technology: Surface Mount; ComponentLink1URL: https://www.ckswitches.com/media/1422/js.pdf; Actuator Length: 2mm; Packaging: Cut Tape; Contact Plating: Silver; Contact Material: Copper Alloy; Min Operating Temperature: -40°C; Throw Configuration: SPDT; Switch Function: On-On; Series: JS
U201 = CMP-020-00000-16: MCU 32-bit STM32 ARM Cortex M4 RISC 512KB Flash 1.8V/2.5V/3.3V 64-Pin LQFP Tray; Operating Supply Voltage: 3.3V; Peripherals: Brown-out Detect/Reset,POR,PWM,WDT,DMA; Nominal Supply Current: 1.8uA; Number of ADC Channels: 12; Interface: I2C,SPI,USB,IrDA,SDIO,UART,USART,LIN,I2S; Clock Frequency: 84MHz; Number of USB Channels: 1; Number of Timers/Counters: 8; Number of Channels: 16; Number of PWM Channels: 23; Number of UART Channels: 3; Number of Programmable I/O: 50; Watchdog Timer: Yes; Max Power Dissipation: 313mW; Min Supply Voltage: 1.7V; Data Bus Width: 32b; RAM Size: 96KB; Max Supply Voltage: 3.6V; Oscillator Type: Internal; ComponentLink1Description: Datasheet; Memory Format: FLASH; Memory Size: 512KB; Case/Package: LQFP; Core Architecture: ARM; Pins: 64; ComponentLink1URL: https://www.st.com/content/ccc/resource/technical/document/datasheet/30/91/86/2d/db/94/4a/d6/DM00102166.pdf/files/DM00102166.pdf/jcr:content/translations/en.DM00102166.pdf; Height: 1.6mm; Series: STM32 F4; Packaging: Tray; Reach SVHC Compliant: No; RoHS Compliant: Yes; Number of I/Os: 50; Frequency: 84MHz; Max Operating Temperature: 85°C; Min Operating Temperature: -40°C; Weight: 0.012088oz; Number of I2C Channels: 3; Package Quantity: 960; Number of SPI Channels: 3; Number of A/D Converters: 1; Radiation Hardening: No; Lead Free: Lead Free
Y201 = CMP-003-00000-11: Crystal 24MHz ±10ppm (Tol) ±10ppm (Stability) 12pF FUND 50Ohm 4-Pin Mini-CSMD T/R; pin to pad: 2>2+4; Case/Package: 4-SMD, No Lead; Frequency: 24MHz; Size: 0.079" L x 0.063" W (2.00mm x 1.60mm); Load Capacitance: 12pF; ComponentLink1Description: Datasheet; ComponentLink1URL: https://ecsxtal.com/store/pdf/ECX-1637B.pdf

## Sheet 3_EVB-A32S1-M_Motor.SchDoc: EVB-A32S1-M
size A4; SheetNumber: 3; SheetTotal: 4
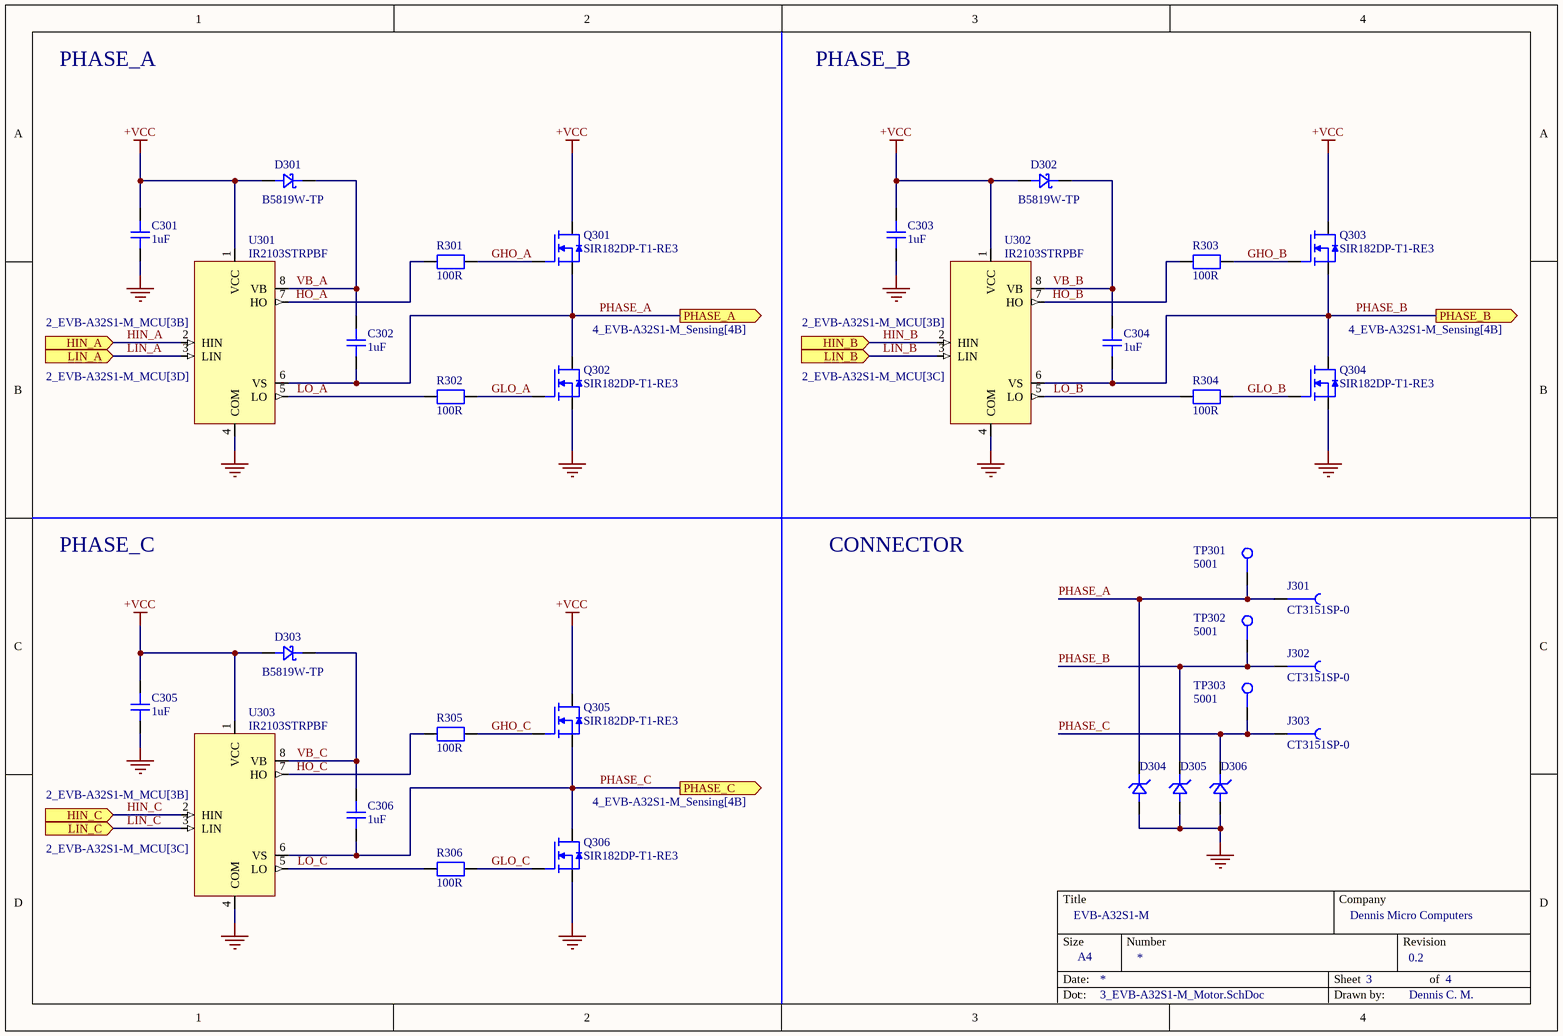
[diagram p2: 3_EVB-A32S1-M_Motor.SchDoc]

### Parts
C301  value 1uF  [C_Yageo_CC_0603_A]  (hidden comment: CC0603KRX7R7BB105)
C302  value 1uF  [C_Yageo_CC_0603_A]  (hidden comment: CC0603KRX7R7BB105)
C303  value 1uF  [C_Yageo_CC_0603_A]  (hidden comment: CC0603KRX7R7BB105)
C304  value 1uF  [C_Yageo_CC_0603_A]  (hidden comment: CC0603KRX7R7BB105)
C305  value 1uF  [C_Yageo_CC_0603_A]  (hidden comment: CC0603KRX7R7BB105)
C306  value 1uF  [C_Yageo_CC_0603_A]  (hidden comment: CC0603KRX7R7BB105)
D301  B5819W-TP  [D_Schottky_MCC_SOD-123]
D302  B5819W-TP  [D_Schottky_MCC_SOD-123]
D303  B5819W-TP  [D_Schottky_MCC_SOD-123]
D304  SMBJ15A-13-F  [D_TVS_Uni_Diodes_DO-214AA_B]  (value not drawn)
D305  SMBJ15A-13-F  [D_TVS_Uni_Diodes_DO-214AA_B]  (value not drawn)
D306  SMBJ15A-13-F  [D_TVS_Uni_Diodes_DO-214AA_B]  (value not drawn)
J301  CT3151SP-0  [J_CalTest_CT3151SP-0]
J302  CT3151SP-0  [J_CalTest_CT3151SP-0]
J303  CT3151SP-0  [J_CalTest_CT3151SP-0]
Q301  SIR182DP-T1-RE3  [Q_Vishay_PowerPACK-SO-8-Single]
Q302  SIR182DP-T1-RE3  [Q_Vishay_PowerPACK-SO-8-Single]
Q303  SIR182DP-T1-RE3  [Q_Vishay_PowerPACK-SO-8-Single]
Q304  SIR182DP-T1-RE3  [Q_Vishay_PowerPACK-SO-8-Single]
Q305  SIR182DP-T1-RE3  [Q_Vishay_PowerPACK-SO-8-Single]
Q306  SIR182DP-T1-RE3  [Q_Vishay_PowerPACK-SO-8-Single]
R301  value 100R  [R_Yageo_RCL_1206_A]  (hidden comment: RC1206FR-07100RL)
R302  value 100R  [R_Yageo_RCL_1206_A]  (hidden comment: RC1206FR-07100RL)
R303  value 100R  [R_Yageo_RCL_1206_A]  (hidden comment: RC1206FR-07100RL)
R304  value 100R  [R_Yageo_RCL_1206_A]  (hidden comment: RC1206FR-07100RL)
R305  value 100R  [R_Yageo_RCL_1206_A]  (hidden comment: RC1206FR-07100RL)
R306  value 100R  [R_Yageo_RCL_1206_A]  (hidden comment: RC1206FR-07100RL)
TP301  5001  [TP_Keystone_TH]
TP302  5001  [TP_Keystone_TH]
TP303  5001  [TP_Keystone_TH]
U301  IR2103STRPBF  [U_Infineon_8-SOIC_3.9mm]
U302  IR2103STRPBF  [U_Infineon_8-SOIC_3.9mm]
U303  IR2103STRPBF  [U_Infineon_8-SOIC_3.9mm]

### Ports
HIN_A (in, see 2_EVB-A32S1-M_MCU[3B]), HIN_B (in, see 2_EVB-A32S1-M_MCU[3B]), HIN_C (in, see 2_EVB-A32S1-M_MCU[3B]), LIN_A (in, see 2_EVB-A32S1-M_MCU[3D]), LIN_B (in, see 2_EVB-A32S1-M_MCU[3C]), LIN_C (in, see 2_EVB-A32S1-M_MCU[3C]), PHASE_A (out, see 4_EVB-A32S1-M_Sensing[4B]), PHASE_B (out, see 4_EVB-A32S1-M_Sensing[4B]), PHASE_C (out, see 4_EVB-A32S1-M_Sensing[4B])

### Nets
+VCC: C301.2 C303.2 C305.2 D301.2 D302.2 D303.2 Q301.1(D) Q303.1(D) Q305.1(D) U301.1(VCC) U302.1(VCC) U303.1(VCC)
GND: C301.1 C303.1 C305.1 D304.2 D305.2 D306.2 Q302.3(S) Q304.3(S) Q306.3(S) U301.4(COM) U302.4(COM) U303.4(COM)
GHO_A: Q301.2(G) R301.2
GHO_B: Q303.2(G) R303.2
GHO_C: Q305.2(G) R305.2
GLO_A: Q302.2(G) R302.2
GLO_B: Q304.2(G) R304.2
GLO_C: Q306.2(G) R306.2
HIN_A: U301.2(HIN) ; port HIN_A
HIN_B: U302.2(HIN) ; port HIN_B
HIN_C: U303.2(HIN) ; port HIN_C
HO_A: R301.1 U301.7(HO)
HO_B: R303.1 U302.7(HO)
HO_C: R305.1 U303.7(HO)
LIN_A: U301.3(LIN) ; port LIN_A
LIN_B: U302.3(LIN) ; port LIN_B
LIN_C: U303.3(LIN) ; port LIN_C
LO_A: R302.1 U301.5(LO)
LO_B: R304.1 U302.5(LO)
LO_C: R306.1 U303.5(LO)
PHASE_A: C302.1 D304.1 J301.1 Q301.3(S) Q302.1(D) TP301.1 U301.6(VS) ; port PHASE_A
PHASE_B: C304.1 D305.1 J302.1 Q303.3(S) Q304.1(D) TP302.1 U302.6(VS) ; port PHASE_B
PHASE_C: C306.1 D306.1 J303.1 Q305.3(S) Q306.1(D) TP303.1 U303.6(VS) ; port PHASE_C
VB_A: C302.2 D301.1 U301.8(VB)
VB_B: C304.2 D302.1 U302.8(VB)
VB_C: C306.2 D303.1 U303.8(VB)

### Notes on the sheet
- PHASE_A
- PHASE_B
- PHASE_C
- CONNECTOR
- Title
- Company
- Size
- Date:
- A4
- Number
- Sheet
- Revision
- of
- Doc:
- Drawn by:

### Library data of the parts
C301-C306 = CMP-001-00019-5: as C201 on sheet 2_EVB-A32S1-M_MCU; Case Code (Imperial): 0603; ComponentLink1URL: https://www.yageo.com/upload/media/product/productsearch/datasheet/mlcc/UPY-GPHC_X7R_6.3V-to-250V_24.pdf; Pins: 2; Width: 0.031inch; Tolerance: 10%; Height: 0.8mm; Radiation Hardening: No; Lead Free: Lead Free; Material: Ceramic; Reach SVHC Compliant: Unknown; Case Code (Metric): 1608; Min Operating Temperature: -55°C; Case/Package: 0603; Package Quantity: 1; Thickness: 0.035inch; Packaging: Tape and Reel; Series: CC; Termination: SMD/SMT; Max Operating Temperature: 125°C; Construction: Flat; Depth: 0.8mm; Halogen Free: Halogen Free; RoHS Compliant: Yes; Voltage Rating (DC): 16V; Dielectric: X7R; Length: 1.6mm; Voltage Rating: 16V; Mounting Technology: Surface Mount; ComponentLink1Description: Datasheet
D301-D303 = CMP-000001-3: Rectifier Diode, Schottky, 1 Phase, 1 Element, 1A, 40V V(RRM), Silicon; Max Reverse Voltage (DC): 20V; Max Forward Surge Current (Ifsm): 10A; Forward Voltage: 550mV; Max Reverse Current: 1mA; Max Power Dissipation: 250mW; Packaging: Tape and Reel; ComponentLink1Description: Datasheet; Max Operating Temperature: 125°C; Mounting Technology: Surface Mount; RoHS Compliant: Yes; Forward Current: 1A; Average Rectified Current: 1A; Series: -; Min Operating Temperature: -65°C; ComponentLink1URL: https://www.mccsemi.com/pdf/Products/B5817W-B5819W(SOD-123).pdf; Max Repetitive Reverse Voltage (Vrrm): 40V; Package Quantity: 3000; Reverse Voltage (DC): 40V
D304-D306 = CMP-004-00005-3: TVS Diode Single Uni-Dir 15V 600W 2-Pin SMB T/R / TVS DIODE 15VWM 24.4VC SMB; Max Reverse Leakage Current: 5uA; Max Surge Current: 24A; Diode Type: ZENER; Power Line Protection: No; Direction: Unidirectional; Breakdown Voltage: 19.2V; Clamping Voltage: 24.4V; Value: 800pF; Min Breakdown Voltage: 16.7V; Number of Unidirectional Channels: 1; Forward Voltage: 5V; Test Current: 1mA; Working Voltage: 15V; Max Power Dissipation: 600W; Reverse Standoff Voltage: 15V; Case/Package: SMB; Max Operating Temperature: 150°C; Mounting Technology: Surface Mount; Peak Pulse Current: 24A; Packaging: Tape and Reel; RoHS Compliant: Yes; Package Quantity: 3000; Series: SMBJ; Termination: SMD/SMT; Polarity: Unidirectional; Peak Pulse Power: 600W; Min Operating Temperature: -55°C; Clamping Voltage-Max: 24.4V; Height: 2.62mm; Lead Free: Lead Free; Leakage Current: 5uA; Length: 4.57mm; Max Breakdown Voltage: 19.2V; Max Output current: 24A; Number of Elements: 1; Pins: 2; Power Dissipation: 600W; Radiation Hardening: No; Reverse Breakdown Voltage: 16.7V; Voltage Rating (DC): 15V; Width: 3.9mm
J301-J303 = CMP-002-00000-17: Conn 4mm Safety Banana Jack F 1 POS Solder RA Thru-Hole 1 Port Bag; pin to pad: 1>1+2+3+4; Gender: Female; Insulation: Mating End Insulated; Body Material: Nylon,Polyamide,PA66; Series: Cal Test; Max Operating Temperature: 80°C; Termination: Solder; ComponentLink1URL: https://mm.digikey.com/Volume0/opasdata/d220001/medias/docus/4846/DS_1768_Catalog.pdf; ComponentLink1Description: Datasheet; Contact Plating: Nickel; Mounting Technology: Through Hole,Panel; Min Operating Temperature: -20°C; Contact Material: Brass; Packaging: Bulk; Color: Black
Q301-Q306 = CMP-013-00000-9: TrenchFET Gen IV Power MOSFET N-Channel Single 60V VDS ±20V VGS 60A ID 8-Pin PowerPAK SOIC T/R; pin to pad: 1>5+6+7+8 2>4 3>1+2+3; Rds On Max: 2.8mR; Max Power Dissipation: 69.4W; Input Capacitance: 3.25nF; Continuous Drain Current (ID): 60A; Max Operating Temperature: 150°C; Mounting Technology: Surface Mount; ComponentLink1URL: https://www.vishay.com/docs/77800/sir182dp.pdf; ComponentLink1Description: Datasheet; Drain to Source Voltage (Vdss): 60V; Packaging: Cut Tape; Series: TrenchFET® Gen IV; Min Operating Temperature: -55°C
R301-R306 = CMP-009-00004-12: SMD Chip Resistor, 100 Ohm, ± 1%, 250 mW, 1206 [3216 Metric], Thick Film, General Purpose; Max Power Dissipation: 250mW; Voltage Rating (AC): 200V; Temperature Coefficient: 100ppm/°C; Series: RC; Tolerance: 1%; Width: 1.6mm; Lead Free: Lead Free; Number of Terminations: 2; Termination: SMD/SMT; Case/Package: 1206; Height: 0.55mm; Case Code (Metric): 3216; Reach SVHC Compliant: Unknown; ComponentLink1Description: Datasheet; Technology: THICK FILM; Voltage Rating: 200V; Features: Moisture Resistant; Power Rating: 250mW; Min Operating Temperature: -55°C; Package Quantity: 5000; RoHS Compliant: Yes; Packaging: Tape and Reel; Depth: 1.6mm; Length: 3.1mm; Resistance Tolerance: 1%; Max Operating Temperature: 155°C; Case Code (Imperial): 1206; ComponentLink1URL: https://www.yageo.com/upload/media/product/products/datasheet/rchip/PYu-RC_Group_51_RoHS_L_12.pdf; Resistor Type: Thick Film
TP301-TP303 = CMP-000000-5: TEST POINT, PCB, THROUGH HOLE; Product R; Range: -; Connector Colour: Black; Mounting: Through Hole; Body Material: Bronze; Insulation: Insulated; Plating: Silver; Number of Ports: 1; Inside Diameter: 1.27mm; Hole Diameter: 1.6mm; Outside Diameter: 2.54mm; Lead Free: Lead Free; Series: THM; Mounting Technology: Through Hole; Material: Nylon,Bronze,Silver; Color: Black; Packaging: Bulk; ComponentLink1URL: https://www.keyelco.com/userAssets/file/M65p56.pdf; Housing Color: Black; Reach SVHC Compliant: No; ComponentLink1Description: Datasheet; RoHS Compliant: Yes; Termination: Through Hole; Contact Plating: Tin,Silver; Diameter: 2.54mm; Insulation Material: Nylon; Contact Material: Bronze; Orientation: Straight; Number of Contacts: 1; Length: 7.62mm; Package Quantity: 100
U301-U303 = CMP-024-00000-6: 600 V half-bridge gate driver IC with shoot through protection, SOIC 8N, RoHS; Number of Outputs: 2; Max Supply Voltage: 20V; Propagation Delay: 680ns; Fall Time: 60ns; Channel Type: Independent; Output Current: 360mA; Mounting Technology: Surface Mount; Case/Package: SOIC; ComponentLink1Description: Datasheet; ComponentLink1URL: https://www.infineon.com/dgdl/ir2103.pdf?fileId=5546d462533600a4015355c7b54b166f; Width: 0.157inch; Halogen Free: Not Halogen Free; Height: 0.059inch; Number of Channels: 2; Series: -; Pins: 8; Lead Free: Lead Free; Length: 0.196inch; RoHS Compliant: Yes; Max Operating Temperature: 150°C; Number of Drivers: 2; Min Operating Temperature: -40°C; Max Output current: 360mA; Packaging: Cut Tape